# EAGLE design motor_board (EAGLE 6.3)
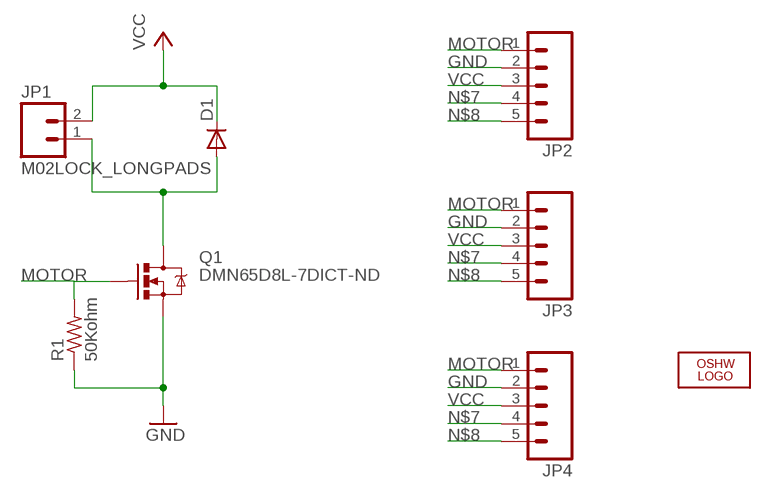
[diagram p0: schematic, sheet 1]

## Parts
D1  DIODE-DO214AA  [DO214AA]
JP1  M02LOCK_LONGPADS  [1X02_LOCK_LONGPADS]
JP2  M05PTH  [1X05]
JP3  M05PTH  [1X05]
JP4  M05PTH  [1X05]
LOGO2  OSHW_LOGO_6MILX0100-NT  [OSHW_6X100_NOTEXT]
Q1  DMN65D8L-7DICT-ND  MOSFET-NCHANNELBSS138  [SOT23]
R1  50Kohm  R-US_M1206  [M1206]

## Nets
GND: JP2.2 JP3.2 JP4.2 Q1.2(S) R1.1
MOTOR: JP2.1 JP3.1 JP4.1 Q1.1(G) R1.2
N$2: D1.A JP1.1 Q1.3(D)
N$7: JP2.4 JP3.4 JP4.4
N$8: JP2.5 JP3.5 JP4.5
VCC: D1.C JP1.2 JP2.3 JP3.3 JP4.3

## Library data of the parts
D1 = diode:DIODE-: DIODE
JP1 = SparkFun-Connectors:M02: Standard 2-pin 0.1" header. Use with - straight break away headers ( PRT-00116) - right angle break away headers (PRT-00553) - swiss pins (PRT-00743) - machine pins (PRT-00117) - female headers (PRT-00115) Molex polarized connector foot print use with: PRT-08233 with associated crimp pins and housings. 2.54_SCREWTERM for use with PRT-10571. 3.5mm Screw Terminal footprints for PRT-08084 5mm Screw Terminal footprints for use with PRT-08433
JP2-JP4 = SparkFun-Connectors:M05: Header 5 Standard 5-pin 0.1" header. Use with straight break away headers (SKU : PRT-00116), right angle break away headers (PRT-00553), swiss pins (PRT-00743), machine pins (PRT-00117), and female headers (PRT-00115). Molex polarized connector foot print use with SKU : PRT-08230 with associated crimp pins and housings.
LOGO2 = ohw-logo:OSHW_LOGO_6MIL
Q1 = SparkFun-DiscreteSemi:MOSFET-NCHANNEL: Common NMOSFET Parts MFG P/N Store ID Prod ID FDD8780 TRANS-09984 SI7820DN TRANS-11055 FDS6630A IC-08089 2N7002PW TRANS-11151 FQP30N06L COM-10213 TRANS-10060 BSS123LT1G TRANS-08345 BSS138 TRANS-00830 BS170 2N7000; PROD_ID: TRANS-00830
R1 = resistor:R-US_: RESISTOR, American symbol

## Board
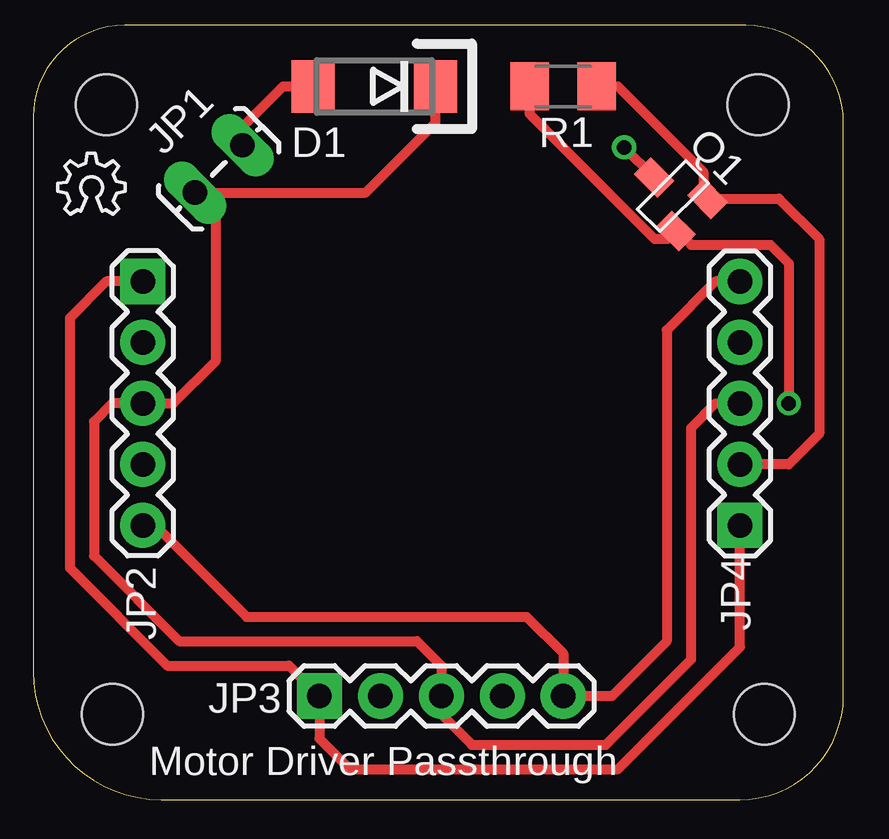
[diagram p1: board, top side]
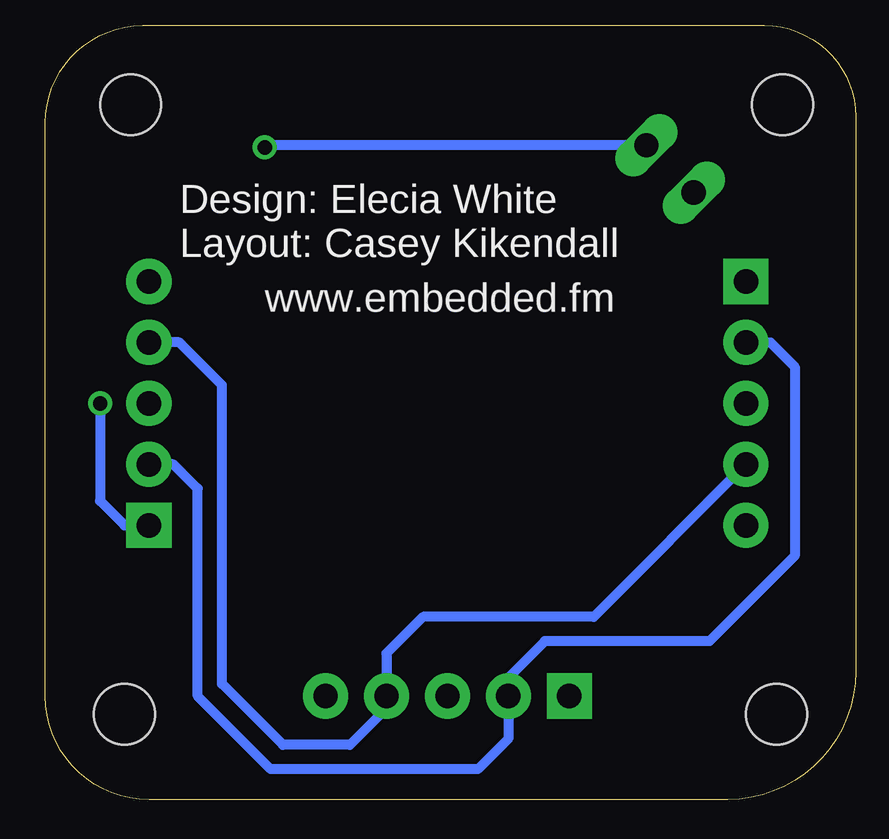
[diagram p2: board, bottom side, seen from below]

No outline drawn. Coordinates in mm, seen from the top.
Copper layers (1*16): Top 0.035mm / dielectric 1.5mm / Bottom 0.035mm
Design rules "default": minimum track width 10mil, minimum drill 24mil, track to track 8mil, track to pad 8mil, pad to pad 8mil, via to via 8mil, smd to smd 8mil, copper to edge 40mil, drill to drill 8mil, minimum pad ring 10mil, minimum via ring 8mil, stop-mask expansion 4mil, vias tented up to drill 0mil, thermal gap 10mil
Holes 2.54 mm at 3.3,3.3 30.48,3.3 30.23,28.7 3.05,28.7
Milling: 8 lines

### Footprints (pad centres in the part's own frame; a part is rotated, then mirrored left to right if it is on the bottom)
DO214AA = smd 1.8 x 2.2: A 2.55,0; C -2.55,0
1X02_LOCK_LONGPADS = drill 1.016 long: 1 -0.127,0; 2 2.667,0
1X05 = drill 1.016 pad 1.88 square: 1 0,0 | drill 1.016 pad 1.88: 2 2.54,0; 3 5.08,0; 4 7.62,0; 5 10.16,0
SOT23 = smd 1 x 1.4: 1 -0.95,-1.1; 2 0.95,-1.1; 3 0,1.1
M1206 = smd 1.6 x 2: 1 -1.4,0; 2 1.4,0

### Placement (x,y rotation side)
D1  14.22,29.46 180 top
JP1  8.64,26.92 225 top
JP2  4.57,21.34 270 top
JP3  11.94,4.06 0 top
JP4  29.46,11.18 90 top
LOGO2  1.02,24.13 0 top
Q1  26.67,24.89 45 top
R1  22.1,29.46 180 top

### Tracks (layer width: path | path; a pad name or v marks a point on that pad's centre or on a via)
GND
  Top 0.406: JP4.2 31.5,13.72 32.77,14.99 32.77,23.11 31.09,24.79 Q1.2 27.94,24.96 27.94,25.91 24.38,29.46 R1.1
  Bottom 0.406: JP4.2 28.45,13.72 27.43,12.7 27.43,4.06 24.38,1.02 15.75,1.02 14.48,2.29 JP3.2 14.48,4.83 12.95,6.35 6.1,6.35 2.54,9.91 2.54,17.78 3.56,18.8 JP2.2
MOTOR  (via drill 0.6)
  Top 0.406: JP4.1 29.46,6.1 24.38,1.02 13.21,1.02 11.94,2.29 JP3.1 10.67,5.33 5.59,5.33 1.52,9.4 1.52,19.81 3.05,21.34 JP2.1 | v31.5,16.26 31.5,22.1 30.73,22.86 27.43,22.86 26.85,23.44 Q1.1 26.45,23.11 25.91,23.11 20.7,28.32 R1.2
  Bottom 0.406: v31.5,16.26 31.5,12.19 30.48,11.18 JP4.1
N$2  (via drill 0.6)
  Top 0.406: JP1.1 8.73,27.78 10.41,29.46 D1.A | v24.64,26.92 | v24.64,26.92 Q1.3
  Bottom 0.406: JP1.1 24.55,27.01 v24.64,26.92
N$7
  Bottom 0.406: JP4.4 28.19,18.8 26.42,17.02 26.42,4.57 23.88,2.03 21.08,2.03 19.56,3.56 JP3.4 19.56,5.84 18.03,7.37 10.92,7.37 JP2.4
N$8
  Top 0.406: JP4.5 28.45,21.34 26.42,19.3 26.42,6.35 24.13,4.06 JP3.5 22.1,5.84 20.57,7.37 8.89,7.37 5.08,11.18 JP2.5
VCC
  Top 0.406: JP4.3 28.45,16.26 27.43,15.24 27.43,5.59 23.88,2.03 18.29,2.03 17.02,3.3 JP3.3 17.02,5.33 16,6.35 6.1,6.35 2.54,9.91 2.54,15.49 3.3,16.26 JP2.3 5.84,16.26 7.62,18.03 7.62,24.17 JP1.2 13.86,25.04 16.76,27.94 D1.C

### Text on the board
tNames: Motor Driver Passthrough
bNames: Design: Elecia White / Layout: Casey Kikendall | www.embedded.fm